# EAGLE design BNC_1_1 (EAGLE 8.3.2)
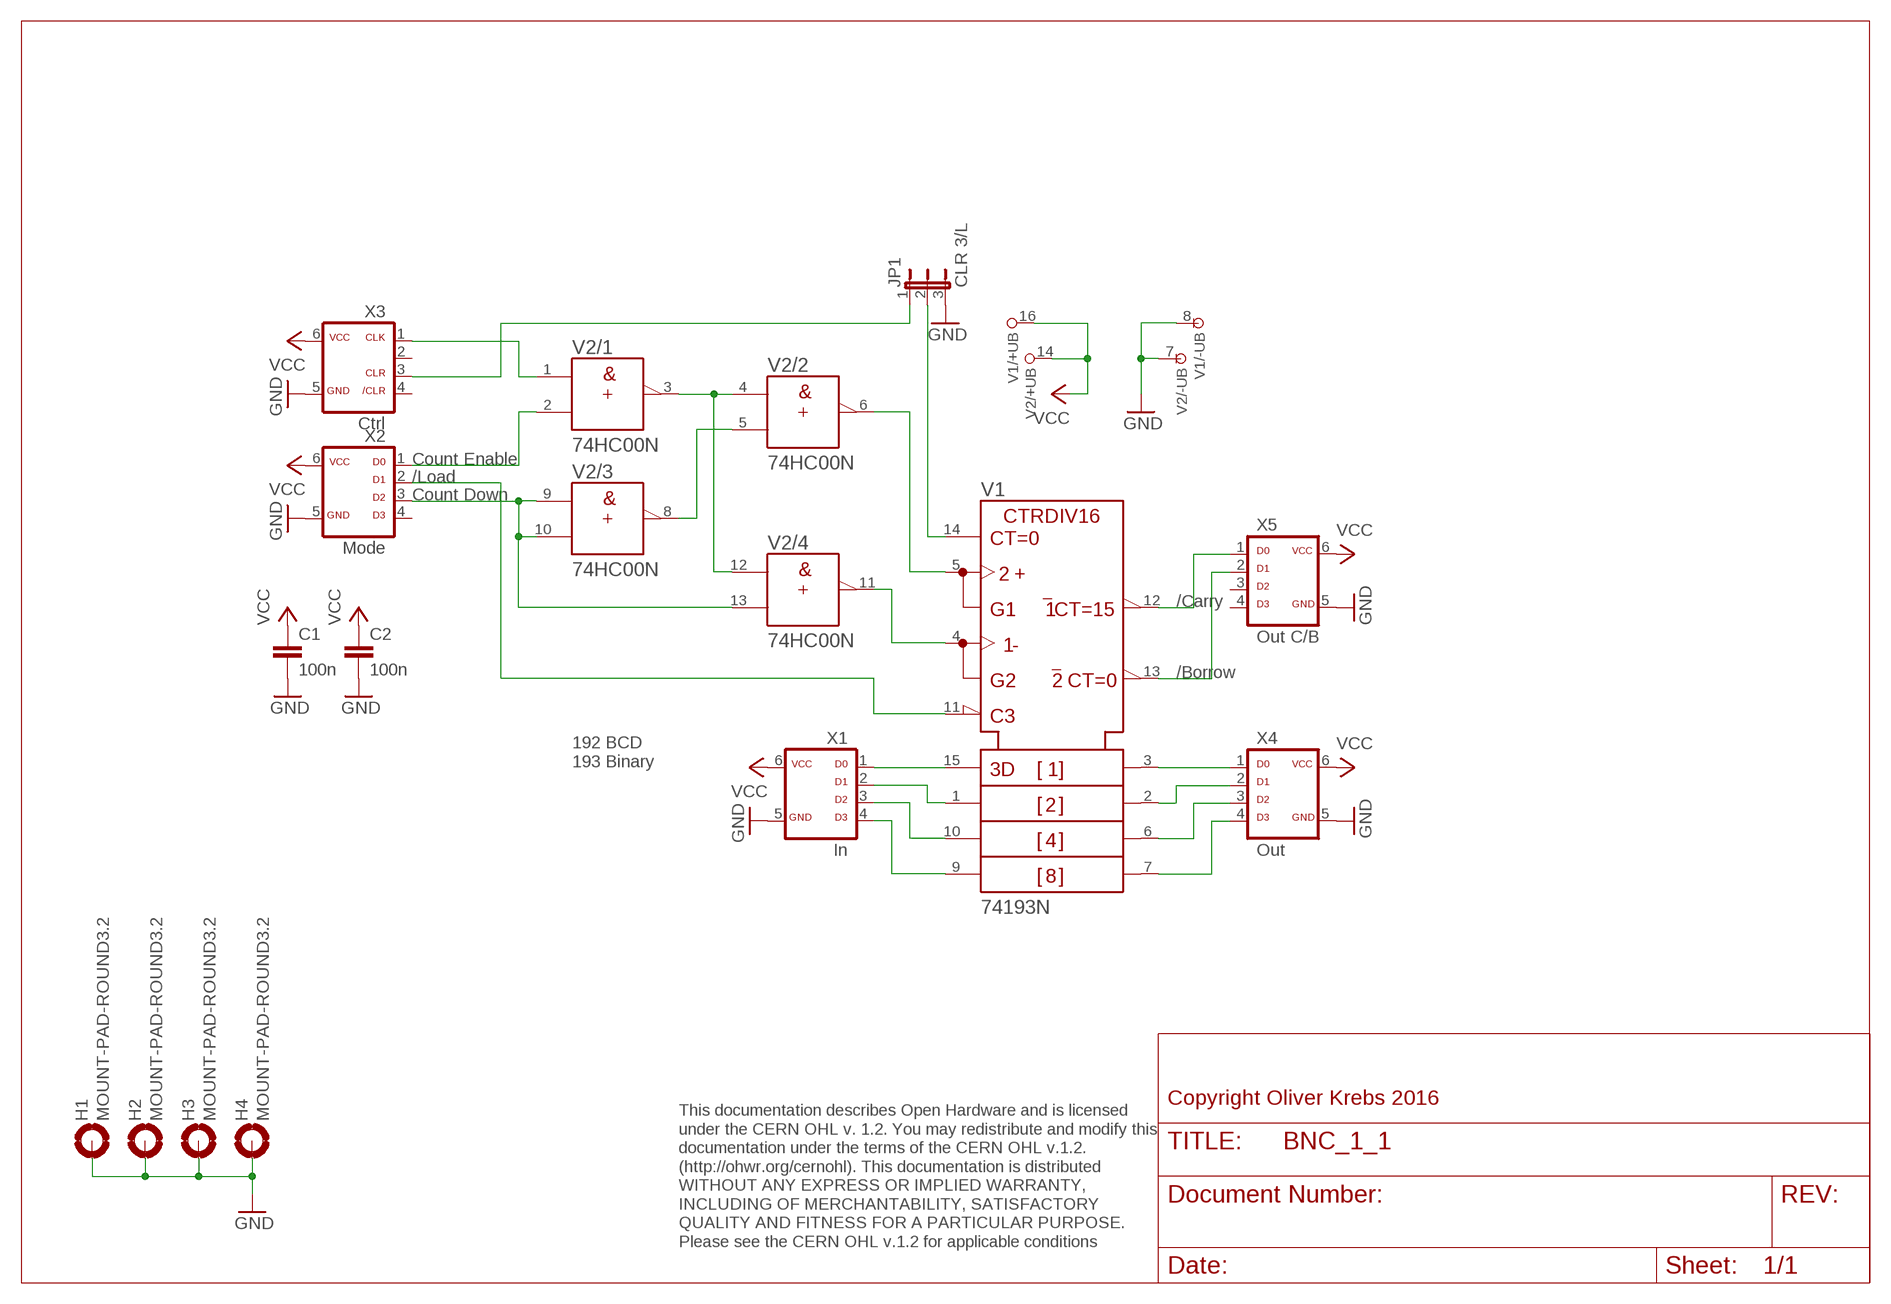
[diagram p0: schematic, sheet 1]

## Parts
C1  100n  C-EU050-025X075  [C050-025X075]
C2  100n  C-EU050-025X075  [C050-025X075]
H1  MOUNT-PAD-ROUND3.2  [3,2-PAD]
H2  MOUNT-PAD-ROUND3.2  [3,2-PAD]
H3  MOUNT-PAD-ROUND3.2  [3,2-PAD]
H4  MOUNT-PAD-ROUND3.2  [3,2-PAD]
JP1  CLR 3/L  JP2E  [JP2]
V1  74193N  [DIL16]
V2  74HC00N  [DIL14]
X1  In  ML6D  [ML-6]
X2  Mode  ML6D  [ML-6]
X3  Ctrl  ML6C  [ML-6]
X4  Out  ML6D  [ML-6]
X5  Out C/B  ML6D  [ML-6]

## Nets
GND: C1.2 C2.2 H1.B3,2(MOUNT) H2.B3,2(MOUNT) H3.B3,2(MOUNT) H4.B3,2(MOUNT) JP1.3 V1.8(-UB) V2.7(/-UB:-UB) X1.5 X2.5 X3.5 X4.5 X5.5
N$1: V1.15(A) X1.1
N$2: V1.1(B) X1.2
N$3: V1.10(C) X1.3
N$4: V1.9(D) X1.4
N$5: V1.3(QA) X4.1
N$6: V1.2(QB) X4.2
N$7: V1.6(QC) X4.3
N$8: V1.7(QD) X4.4
N$9: V1.13(!BO) X5.2
N$10: V1.12(!CO) X5.1
N$11: V2.1(/1:A) X3.1
N$12: V2.5(/2:B) V2.8(/3:Y)
N$13: V2.3(/1:Y) V2.4(/2:A) V2.12(/4:A)
N$14: V1.5(UP) V2.6(/2:Y)
N$15: V1.4(DOWN) V2.11(/4:Y)
N$16: JP1.2 V1.14(CLR)
N$17: V2.9(/3:A) V2.10(/3:B) V2.13(/4:B) X2.3
N$18: V2.2(/1:B) X2.1
N$19: V1.11(!LOAD) X2.2
N$20: JP1.1 X3.3
VCC: C1.1 C2.1 V1.16(+UB) V2.14(/+UB:+UB) X1.6 X2.6 X3.6 X4.6 X5.6
Unconnected: X2.4 X3.2 X3.4 X5.3 X5.4

## Notes on the sheet
- Count Enable
- /Load
- Count Down
- /Carry
- /Borrow
- 192 BCD
  193 Binary
- Copyright Oliver Krebs 2016
- This documentation describes Open Hardware and is licensed 
  under the CERN OHL v. 1.2. You may redistribute and modify this 
  documentation under the terms of the CERN OHL v.1.2. 
  (http://ohwr.org/cernohl). This documentation is distributed
  WITHOUT ANY EXPRESS OR IMPLIED WARRANTY, 
  INCLUDING OF MERCHANTABILITY, SATISFACTORY 
  QUALITY AND FITNESS FOR A PARTICULAR PURPOSE. 
  Please see the CERN OHL v.1.2 for applicable conditions

## Library data of the parts
C1 C2 = 01-my_rcl:C-EU: CAPACITOR, European symbol
H1-H4 = holes:MOUNT-PAD-ROUND: MOUNTING PAD, round
JP1 = jumper:JP2E: JUMPER
V1 = 74ttl-din:74*193: Synchronus 4-bit up down COUNTER
V2 = 74ttl-din:74*00: Quad 2-input NAND gate
X1 X2 X4 X5 = 01-my-con:ML6D
X3 = 01-my-con:ML6C

## Board
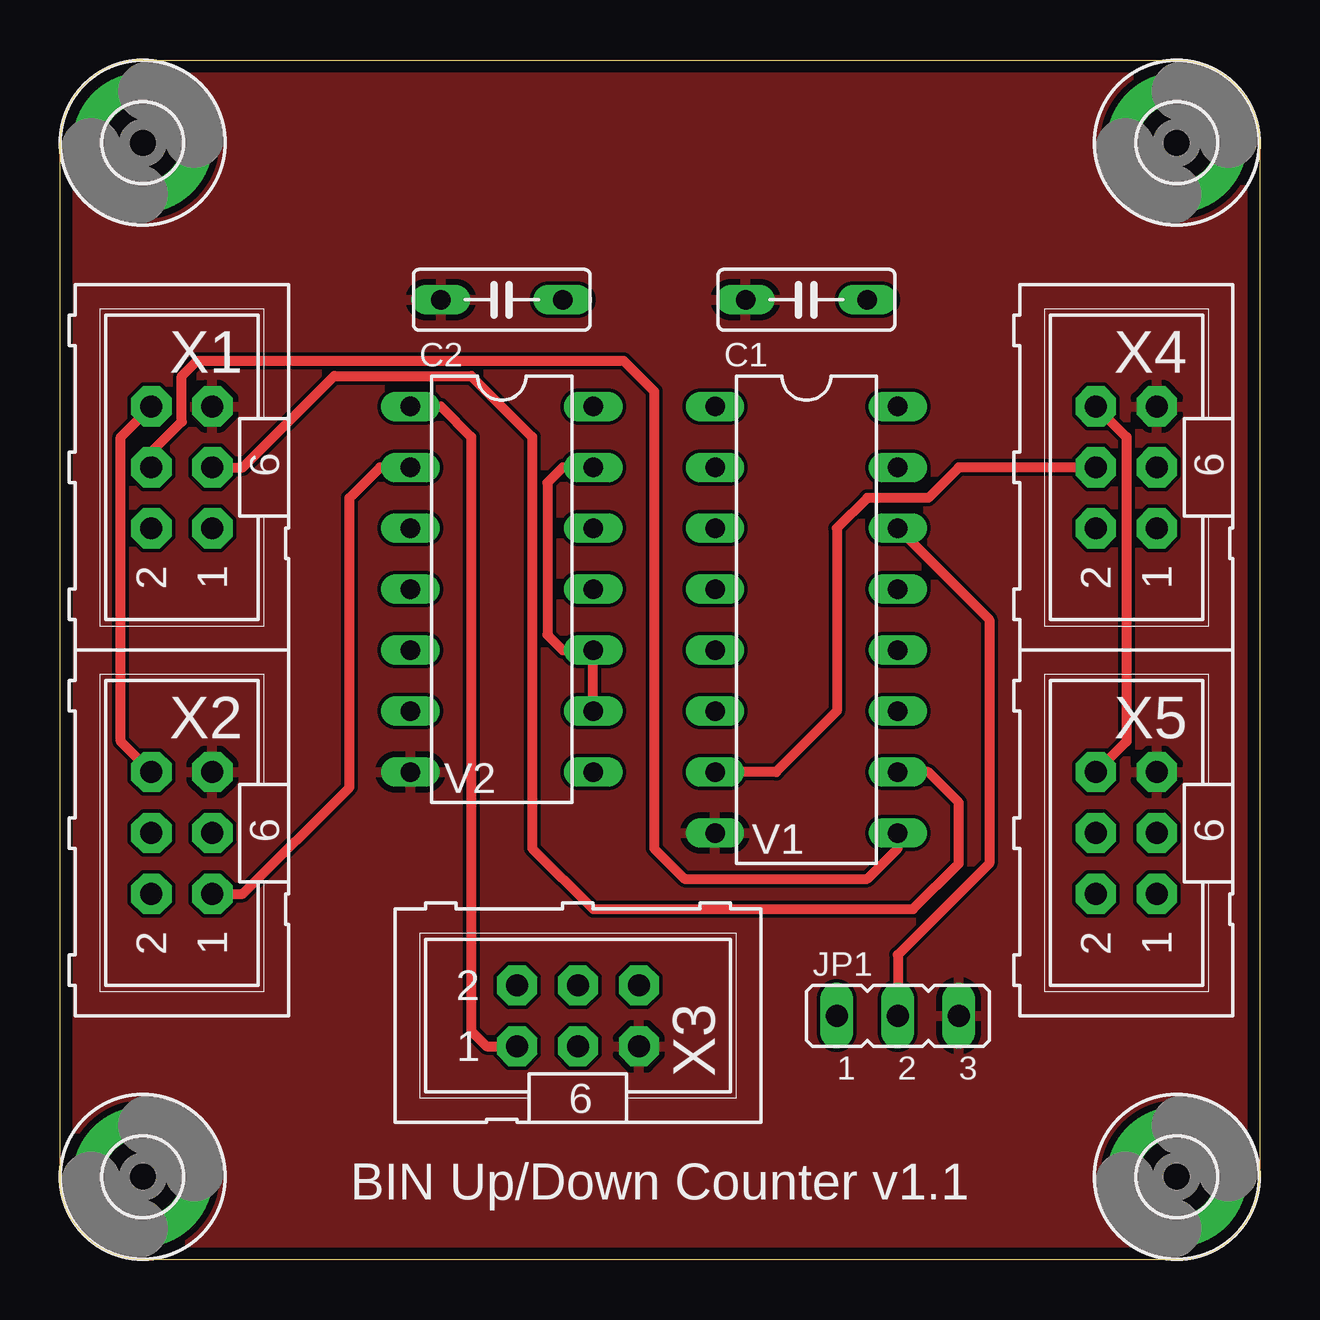
[diagram p1: board, top side]
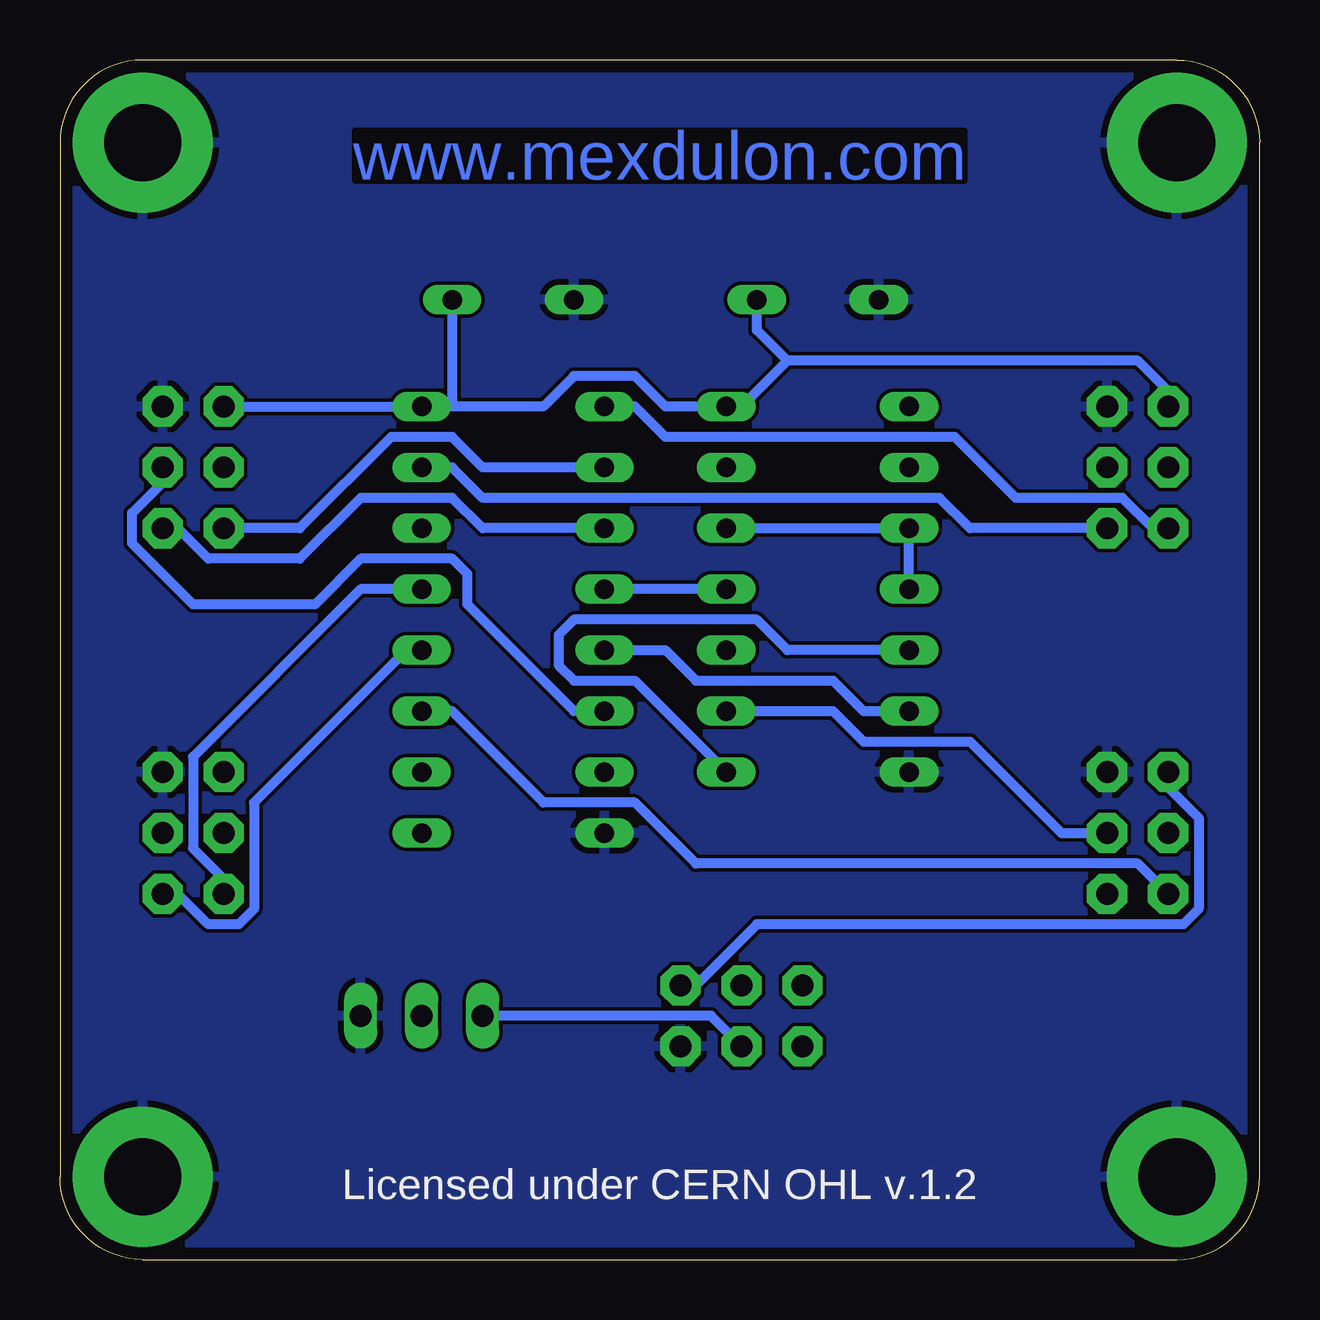
[diagram p2: board, bottom side, seen from below]

Size 50 x 50 mm. Coordinates in mm from the lower left corner, seen from the top.
Outline: 0,3.45 0,46.55 arc-90 3.45,50 46.55,50 arc-90 50,46.55 50,3.45 arc-90 46.55,0 3.45,0 arc-90 0,3.45
Copper layers (1*16): Top 0.035mm / dielectric 1.6mm / Bottom 0.035mm
Design rules "Elecrow_2-layer_PCB_eagle_rule": minimum track width 6mil, minimum drill 12mil, track to track 6mil, track to pad 6mil, pad to pad 6mil, via to via 8mil, smd to smd 0mil, copper to edge 20mil, drill to drill 10mil, minimum pad ring 6mil, minimum via ring 6mil, stop-mask expansion 0mil, vias tented up to drill 100mil, thermal gap 10mil

### Footprints (pad centres in the part's own frame; a part is rotated, then mirrored left to right if it is on the bottom)
C050-025X075 = drill 0.813 long: 1 -2.54,0; 2 2.54,0
3,2-PAD = drill 3.2 pad 5.842: B3,2 0,0
JP2 = drill 0.914 long: 1 -2.54,0; 2 0,0; 3 2.54,0
DIL16 = drill 0.813 long: 1 -8.89,-3.81; 2 -6.35,-3.81; 3 -3.81,-3.81; 4 -1.27,-3.81; 5 1.27,-3.81; 6 3.81,-3.81; 7 6.35,-3.81; 8 8.89,-3.81; 9 8.89,3.81; 10 6.35,3.81; 11 3.81,3.81; 12 1.27,3.81; 13 -1.27,3.81; 14 -3.81,3.81; 15 -6.35,3.81; 16 -8.89,3.81
DIL14 = drill 0.813 long: 1 -7.62,-3.81; 2 -5.08,-3.81; 3 -2.54,-3.81; 4 0,-3.81; 5 2.54,-3.81; 6 5.08,-3.81; 7 7.62,-3.81; 8 7.62,3.81; 9 5.08,3.81; 10 2.54,3.81; 11 0,3.81; 12 -2.54,3.81; 13 -5.08,3.81; 14 -7.62,3.81
ML-6 = drill 0.914 pad 1.676 octagon: 1 -2.54,-1.27; 2 -2.54,1.27; 3 0,-1.27; 4 0,1.27; 5 2.54,-1.27; 6 2.54,1.27

### Placement (x,y rotation side)
C1  31.11,40.01 180 top
C2  18.41,40.01 180 top
H1  3.45,3.45 0 top
H2  3.45,46.55 0 top
H3  46.55,46.55 0 top
H4  46.55,3.45 0 top
JP1  34.92,10.16 0 top
V1  31.11,26.67 270 top
V2  18.41,27.94 270 top
X1  5.08,33.02 90 top
X2  5.08,17.78 90 top
X3  21.59,10.16 0 top
X4  44.45,33.02 90 top
X5  44.45,17.78 90 top

### Tracks (layer width: path | path; a pad name or v marks a point on that pad's centre or on a via)
GND
  pour Bottom: 0,0 50.8,0 50.8,50.8 0,50.8
  pour Top: 0,50.16 50.16,50.16 50.16,0 0,0
N$1
  Bottom 0.406: X1.1 12.06,30.48 13.34,31.75 32.38,31.75 33.66,33.02 V1.15
N$2
  Bottom 0.406: X1.2 4.45,30.48 5.71,31.75 10.16,31.75 12.7,34.29 24.77,34.29 26.04,35.56 V1.1
N$3
  Top 0.406: X1.3 7.62,33.02 11.43,36.83 17.14,36.83 19.68,34.29 19.68,17.14 22.23,14.61 35.56,14.61 37.47,16.51 37.47,19.05 36.2,20.32 V1.10
N$4
  Top 0.406: V1.9 34.92,17.14 33.66,15.88 26.04,15.88 24.77,17.14 24.77,36.2 23.5,37.47 5.71,37.47 5.08,36.83 5.08,34.92 3.81,33.66 X1.4
N$5
  Bottom 0.406: V1.3 32.38,30.48 33.66,31.75 37.47,31.75 40.01,29.21 43.81,29.21 45.09,30.48 X4.1
N$6
  Bottom 0.406: V1.2 32.38,33.02 33.66,34.29 36.2,34.29 40.01,30.48 X4.2
N$7
  Bottom 0.406: V1.6 28.57,22.86 33.02,27.3 33.02,28.57 33.66,29.21 37.47,29.21 39.37,27.3 44.45,27.3 46.99,29.84 46.99,31.11 45.72,32.38 X4.3
N$8
  Top 0.406: X4.4 37.47,33.02 36.2,31.75 33.66,31.75 32.38,30.48 32.38,22.86 29.84,20.32 V1.7
N$9
  Bottom 0.406: V1.13 37.47,27.94 44.45,20.95 44.45,17.14 43.18,15.88 X5.2
N$10
  Bottom 0.406: V1.12 35.56,25.4 41.91,19.05 41.91,14.61 42.55,13.97 43.81,13.97 45.09,15.24 X5.1
N$11
  Top 0.406: V2.1 15.88,35.56 17.14,34.29 17.14,9.53 17.78,8.89 X3.1
N$12
  Bottom 0.406: V2.5 19.68,25.4 20.95,26.67 28.57,26.67 29.21,26.04 29.21,24.77 28.57,24.13 26.04,24.13 V2.8
N$13
  Bottom 0.406: V2.4 V2.3 V2.12
N$14
  Bottom 0.406: V1.5 24.77,25.4 23.5,24.13 17.78,24.13 16.51,22.86 V2.6
N$15
  Bottom 0.406: V2.11 V1.4
N$16
  Top 0.406: V1.14 38.73,26.67 38.73,16.51 34.92,12.7 JP1.2
N$17
  Top 0.406: V2.13 20.95,33.02 20.32,32.38 20.32,26.04 20.95,25.4 V2.10 V2.9
  Bottom 0.406: V2.9 17.78,22.86 16.51,21.59 12.06,21.59 8.26,17.78 X2.3
N$18
  Top 0.406: X2.1 7.62,15.24 12.06,19.68 12.06,31.75 13.34,33.02 V2.2
N$19
  Bottom 0.406: X2.2 5.08,16.51 23.5,16.51 26.04,19.05 29.84,19.05 33.66,22.86 V1.11
N$20
  Bottom 0.406: X3.3 22.86,10.16 JP1.1
VCC
  Top 0.406: X2.6 2.54,21.59 2.54,34.29 X1.6 | X4.6 44.45,34.29 44.45,21.59 X5.6
  Bottom 0.406: X1.6 3.81,36.2 5.08,37.47 19.68,37.47 | 19.68,37.47 20.95,38.73 C2.1 | 19.68,37.47 21.59,35.56 V2.14 24.77,35.56 26.04,36.83 28.57,36.83 29.84,35.56 33.66,35.56 | 33.66,35.56 V1.16 X4.6 | C1.1 33.66,35.56 | X2.6 3.81,19.68 2.54,18.41 2.54,14.61 3.17,13.97 20.95,13.97 23.5,11.43 X3.6

### Text on the board
Bottom: www.mexdulon.com
tNames: BIN Up/Down Counter v1.1
bNames: Licensed under CERN OHL v.1.2
tValues: 1: /Carry / 2: /Borrow | Mode / 1: Cnt En / 2: /Load / 3: Cnt Dwn